# Altium schematic sheet BPM_Mainboard.SchDoc
size B; SheetNumber: 1; SheetTotal: 1
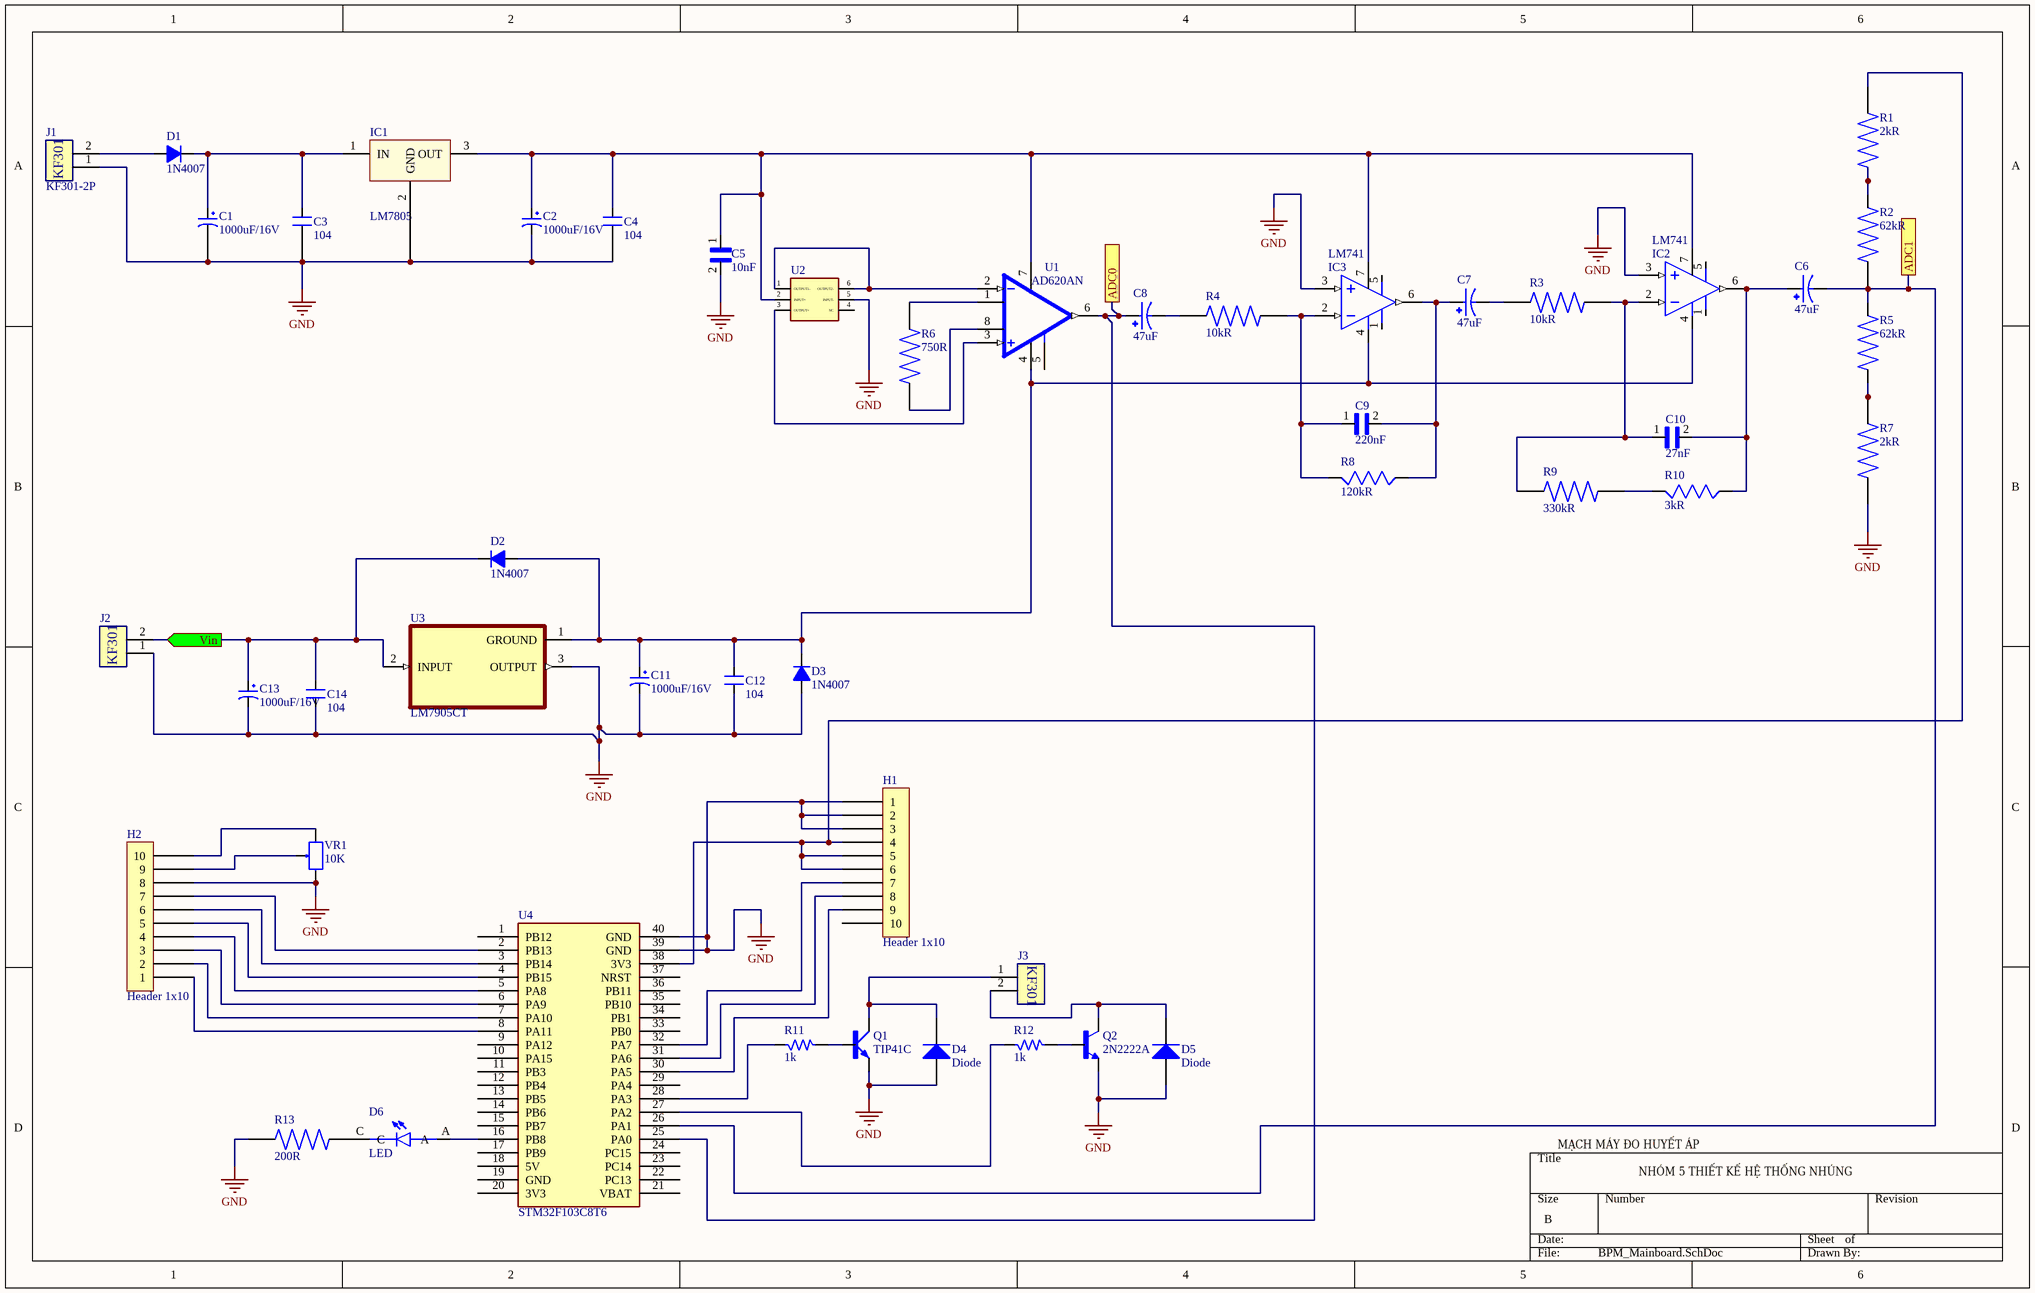
[diagram p0: BPM_Mainboard.SchDoc]

## Parts
C1  1000uF/16V  [CP1.5/3.4]
C2  1000uF/16V  [CP1.5/3.4]
C3  104  [CN2]
C4  104  [CN2]
C5  10nF  [CAPC2012X145N]
C6  47uF  [CAPPRD250W50D630H1120]
C7  47uF  [CAPPRD250W50D630H1120]
C8  47uF  [CAPPRD250W50D630H1120]
C9  220nF  [CAPC3216X94N]
C10  27nF  [CAPC2012X94N]
C11  1000uF/16V  [CP1.5/3.4]
C12  104  [CN2]
C13  1000uF/16V  [CP1.5/3.4]
C14  104  [CN2]
D1  1N4007  [D1A]
D2  1N4007  [D1A]
D3  1N4007  [D1A]
D4  Diode  [DO-41]
D5  Diode  [DO-41]
D6  LED  [LEDC2012X120N]
H1  Header 1x10  [Header 1x10 male]
H2  Header 1x10  [Header 1x10 male]
IC1  LM7805  [QTO-220]
IC2  LM741  [DIP8/W0.3]
IC3  LM741  [DIP8/W0.3]
J1  KF301-2P  [KF301-5.0-2P]
J2  (no value)  [KF301-5.0-2P]
J3  (no value)  [KF301-5.0-2P]
Q1  TIP41C  [TO220AV]
Q2  2N2222A  [TO92254P470H750-3]
R1  2kR  [RESC2012X60N]
R2  62kR  [RESC2012X60N]
R3  10kR  [RESC2012X65N]
R4  10kR  [RESC2012X65N]
R5  62kR  [RESC2012X60N]
R6  750R  [RESC2012X60N]
R7  2kR  [RESC2012X60N]
R8  120kR  [RESC2012X60N]
R9  330kR  [RESC2012X65N]
R10  3kR  [RESC2012X60N]
R11  1k  [SM-1206]
R12  1k  [SM-1206]
R13  200R  [RESC2012X65N]
U1  AD620AN  [DIP787W46P254L1016H533Q8]
U2  (no value)  [MPS20N0200D_Foot]
U3  LM7905CT  [TO254P1054X470X1955-3]
U4  STM32F103C8T6  [Stm32 BluePill]
VR1  10K  [VOL_1]

## Ports
ADC0, ADC1, Vin (in)

## Nets
GND: C1.2 C2.2 C3.2 C4.2 C5.2 C11.2 C12.2 C13.2 C14.2 D3.1(A) D4.1(A) D5.1(A) H1.1 H1.2 H1.3 H2.8 IC1.2(GND) IC2.3(IN+) IC3.3(IN+) J1.1 J2.1 Q1.E Q2.1(E) R7.2 R13.1 U2.5(INPUT-) U3.3(OUTPUT) U4.39(GND) U4.40(GND) VR1.1
ADC0: C8.P U1.6(OUTPUT) U4.25(PA0) ; port ADC0
ADC1: C6.N R2.1 R5.2 U4.26(PA1) ; port ADC1
Vin: C13.1 C14.1 D2.2(K) J2.2 U3.2(INPUT) ; port Vin
NetC1_1: C1.1 C3.1 D1.2(K) IC1.1(IN)
NetC2_1: C2.1 C4.1 C5.1 IC1.3(OUT) IC2.7(+V) IC3.7(+V) U1.7(+VS) U2.2(INPUT+)
NetC6_P: C6.P C10.2 IC2.6(OUT) R10.2
NetC7_N: C7.N R3.1
NetC7_P: C7.P C9.2 IC3.6(OUT) R8.2
NetC8_N: C8.N R4.1
NetC9_1: C9.1 IC3.2(IN-) R4.2 R8.1
NetC10_1: C10.1 IC2.2(IN-) R3.2 R9.1
NetC11_1: C11.1 C12.1 D2.1(A) D3.2(K) IC2.4(-V) IC3.4(-V) U1.4(-VS) U3.1(GROUND)
NetD1_1: D1.1(A) J1.2
NetD4_2: D4.2(K) J3.1 Q1.C
NetD5_2: D5.2(K) J3.2 Q2.3(C)
NetD6_A: D6.A U4.16(PB8)
NetD6_C: D6.C R13.2
NetH1_4: H1.4 H1.5 H1.6 R1.1 U4.38(3V3)
NetH1_7: H1.7 U4.32(PA7)
NetH1_8: H1.8 U4.31(PA6)
NetH1_9: H1.9 U4.30(PA5)
NetH2_1: H2.1 U4.8(PA11)
NetH2_2: H2.2 U4.7(PA10)
NetH2_3: H2.3 U4.6(PA9)
NetH2_4: H2.4 U4.5(PA8)
NetH2_5: H2.5 U4.4(PB15)
NetH2_6: H2.6 U4.3(PB14)
NetH2_7: H2.7 U4.2(PB13)
NetH2_9: H2.9 VR1.2
NetH2_10: H2.10 VR1.3
NetQ1_B: Q1.B R11.2
NetQ2_2: Q2.2(B) R12.2
NetR1_2: R1.2 R2.2
NetR5_1: R5.1 R7.1
NetR6_1: R6.1 U1.8(RG_8)
NetR6_2: R6.2 U1.1(RG_1)
NetR9_2: R9.2 R10.1
NetR11_1: R11.1 U4.28(PA3)
NetR12_1: R12.1 U4.27(PA2)
NetU1_2: U1.2(-IN) U2.1(OUTPUT1-) U2.6(OUTPUT2-)
NetU1_3: U1.3(+IN) U2.3(OUTPUT+)

Not connected (* = marked no-connect by the designer): H1 10; IC2 1(Vos) 5(Vos); IC3 1(Vos) 5(Vos); U1 5(REF); U2 4(NC); U4 1(PB12) 9(PA12) 10(PA15) 11(PB3) 12(PB4) 13(PB5) 14(PB6) 15(PB7) 17(PB9) 18(5V) 19(GND) 20(3V3) 21(VBAT) 22(PC13) 23(PC14) 24(PC15) 29(PA4) 33(PB0) 34(PB1) 35(PB10) 36(PB11) 37(NRST)

## Notes on the sheet
- MẠCH MÁY ĐO HUYẾT ÁP
- NHÓM 5 THIẾT KẾ HỆ THỐNG NHÚNG
- (in symbol KF301-2P) KF301
- (in symbol Terminal_block1) KF301

## Library data of the parts
C1 C2 C11 C13 = CP4: Cap 1000uF/16V - 220uF/50V; Description 5: 4,7uF>10uF/250V_3,3uF>10uF/400V - 2,2uF>4,7uF/450V; Description 1: 2200uF-3300uF/6,3V - 1000uF-2200uF/10V; Description 2: 1000uF/16V - 470uF => 1000uF/25V - 100uF/100V; Description 3: 330uF>470uF/35V_220uF>470uF/50V_10uF>22uF/250V; Description 4: 220uF => 330uF/63V - 10uF =>33uF/160 - 200V; Value: 1000uF/16V
C3 C4 C12 C14 = CN2: Cap np 104 => 105pF; Value: 0.1uF
C5 = VJ0805Y103KXAMC: 0805 10nF 50 V Â±10 % Tolerance X7R SMT Multilayer Ceramic Chip Capacitor; MF: Vishay Vitramon; Package: 0805 Vishay; Availability: In Stock; MP: VJ0805Y103KXAMC; SnapEDA_Link: https://www.snapeda.com/parts/VJ0805Y103KXAMC/Vishay%20Vitramon/view-part/1823129/?ref=snap; Purchase-URL: https://pricing.snapeda.com/search/part/VJ0805Y103KXAMC/?ref=eda; Value: *; Check_prices: https://www.snapeda.com/parts/VJ0805Y103KXAMC/Vishay%20Vitramon/view-part/1823129/?ref=eda; Price: None
C6-C8 = EEUFR1H470: 47ÂµF 50V Aluminum Electrolytic Capacitors Radial, Can 5000 Hrs @ 105Â°C; MF: Panasonic; Value: *; SnapEDA_Link: https://www.snapeda.com/parts/EEUFR1H470/Panasonic/view-part/?ref=snap; Purchase-URL: https://pricing.snapeda.com/search/part/EEUFR1H470/?ref=eda; Price: None; Availability: In Stock; Package: RADIAL-2 Panasonic; MP: EEUFR1H470; Check_prices: https://www.snapeda.com/parts/EEUFR1H470/Panasonic/view-part/?ref=eda
C9 = 12061C123KAT2A: Cap Ceramic 0.012uF 100V X7R 10% SMD 1206 125Â°C Paper T/R; Package: None; Price: None; Value: *; MP: 12061C123KAT2A; Availability: Unavailable
C10 = LD055C273KAB2A: Cap Ceramic 0.027uF 50V X7R 10% SMD 0805 125Â°C Paper T/R; Package: None; Price: None; Value: *; MP: LD055C273KAB2A; Availability: Unavailable
D1-D3 = D1A: Diode 1A; Value: 1N4007
D4 D5 = Diode 1N4007: 1 Amp General Purpose Rectifier; Published: 8-Jun-2000; LatestRevisionDate: 17-Jul-2002; LatestRevisionNote: Re-released for DXP Platform.; DatasheetVersion: 1998; PackageVersion: Aug-1999; PackageReference: DO-41; Publisher: Altium Limited; PackageDescription: Diode, Axial; Body 5.2 x 2.7 mm (LxDia. max), Lead Dia. 0.86 mm (max); Code_JEDEC: DO-204-AL; ComponentLink1Description: Manufacturer Link; ComponentLink1URL: http://www.fairchildsemi.com/; ComponentLink2Description: Datasheet; ComponentLink2URL: http://www.fairchildsemi.com/ds/1N%2F1N4001.pdf
D6 = SML-LXT0805SRW-TR: LED RED DIFFUSED 0805 SMD; Package: None; Price: None; Value: *; MP: SML-LXT0805SRW-TR; Availability: Unavailable
IC1 = LM78xx: On ap +, from + 5 to + 24VDC; Value: LM7805
IC2 IC3 = LM741: Single OA
J2 J3 = Terminal_block1
Q1 = TIP41C: Bipolar _BJT_ Transistor NPN 100V 6A 3MHz 2W Through Hole TO-220-3; MF: Central Semiconductor; SnapEDA_Link: https://www.snapeda.com/parts/TIP41C/Central%20Semiconductor%20Corp/view-part/2759871/?ref=snap; Price: None; Availability: Unavailable; Package: TO-220-3 Central Semiconductor; MP: TIP41C; Value: *
Q2 = 2N2222A: Bipolar (BJT) Transistor NPN 40 V 600 mA 250MHz 625 mW Through Hole TO-92; MF: Diotec Semiconductor; Package: TO-92-3 Diotec; Check_prices: https://www.snapeda.com/parts/2N2222A/Diotec/view-part/?ref=eda; Value: *; Purchase-URL: https://pricing.snapeda.com/search/part/2N2222A/?ref=eda; Availability: In Stock; SnapEDA_Link: https://www.snapeda.com/parts/2N2222A/Diotec/view-part/?ref=snap; MP: 2N2222A; Price: None
R1 R7 = CR0805-JW-202ELF: Package: None; Price: None; Value: *; MP: CR0805-JW-202ELF; Availability: Unavailable
R2 R5 = RC0805JR-0762KL: Resistor: thick film; SMD; 0805; 62kÎ©; 0.125W; Â±5%; -55Ã·155Â°C; Package: None; Price: None; Value: *; MP: RC0805JR-0762KL; Availability: Unavailable
R3 R4 = RMCF0805FT10K0: MF: {'manufacturer': u'Stackpole Electronics Inc'}; Package: None; Price: None; Value: *; MP: RMCF0805FT10K0; Availability: Unavailable
R6 = AF0805JR-07750RL: Package: None; Price: None; Value: *; MP: AF0805JR-07750RL; Availability: Unavailable
R8 = RC0805FR-13120KL: MP: RC0805FR-13120KL; Availability: Unavailable; Package: None; Value: *; Price: None
R9 = SFR10EZPF3303: Package: None; Price: None; Value: *; MP: SFR10EZPF3303; Availability: Unavailable
R10 = RC0805FR-133KL: MF: {'manufacturer': u'YAGEO'}; Package: None; Price: None; Value: *; MP: RC0805FR-133KL; Availability: Unavailable
R11 R12 = R: Resistor 1/4W; Value: R1/4W - 1K
R13 = MCR10EZPJ201: Package: None; Price: None; Value: *; MP: MCR10EZPJ201; Availability: Unavailable
U1 = AD620AN: Instrumentation Amplifier 1 Circuit - 8-PDIP; MF: Analog Devices; Value: *; Purchase-URL: https://pricing.snapeda.com/search/part/AD620AN/?ref=eda; Check_prices: https://www.snapeda.com/parts/AD620AN/Analog+Devices+Inc./view-part/?ref=eda; Price: None; MP: AD620AN; SnapEDA_Link: https://www.snapeda.com/parts/AD620AN/Analog+Devices+Inc./view-part/?ref=snap; Availability: In Stock; Package: PDIP-8 Linear Technology
U2 = MPS20N0200D: Pressure Sensor
U3 = LM7905CT: Linear Voltage Regulator IC 1 Output 1A TO-220-3; MF: ON Semiconductor; Check_prices: https://www.snapeda.com/parts/LM7905CT/ON%20Semiconductor/view-part/1592440/?ref=eda; Price: None; SnapEDA_Link: https://www.snapeda.com/parts/LM7905CT/ON%20Semiconductor/view-part/1592440/?ref=snap; MP: LM7905CT; Value: *; Availability: Warning; Package: TO-220 Texas Instruments; Purchase-URL: https://pricing.snapeda.com/search/part/LM7905CT/?ref=eda
U4 = BluePill: Designed By @Alixahedi
VR1 = Var Resitor: Var Resistor; Value: VR 10K